# Altium schematic sheet HUB.SchDoc
size A4
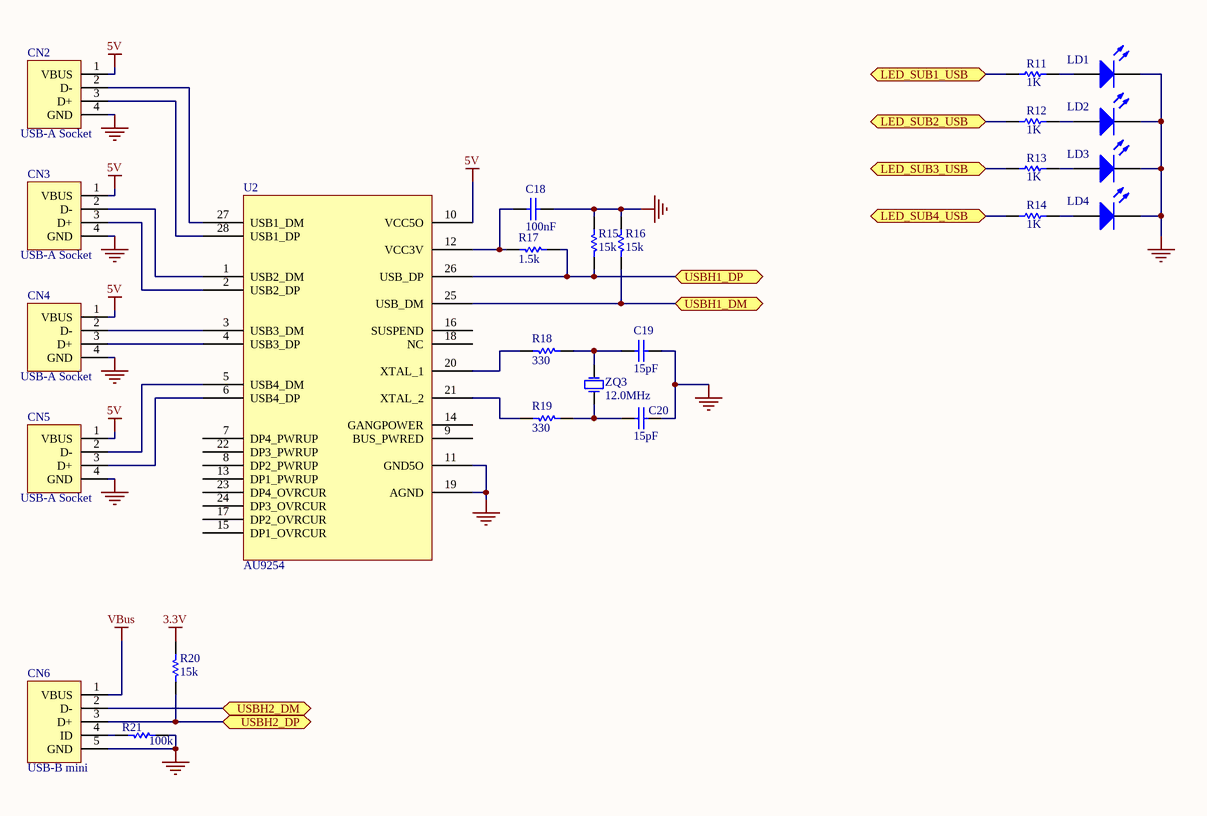
[diagram p0: HUB.SchDoc]

## Parts
C18  value 100nF  [RAD-0.3]  (hidden comment: Cap)
C19  value 15pF  [RAD-0.3]  (hidden comment: Cap)
C20  value 15pF  [RAD-0.3]  (hidden comment: Cap)
CN2  USB-A Socket  [1470695]
CN3  USB-A Socket  [1470695]
CN4  USB-A Socket  [1470695]
CN5  USB-A Socket  [1470695]
CN6  USB-B mini  [USB_micro-B]
LD1  LED1  [LED-1]  (value not drawn)
LD2  LED1  [LED-1]  (value not drawn)
LD3  LED1  [LED-1]  (value not drawn)
LD4  LED1  [LED-1]  (value not drawn)
R11  value 1K  [AXIAL-0.3]  (hidden comment: Res1)
R12  value 1K  [AXIAL-0.3]  (hidden comment: Res1)
R13  value 1K  [AXIAL-0.3]  (hidden comment: Res1)
R14  value 1K  [AXIAL-0.3]  (hidden comment: Res1)
R15  value 15k  [AXIAL-0.3]  (hidden comment: Res1)
R16  value 15k  [AXIAL-0.3]  (hidden comment: Res1)
R17  value 1.5k  [AXIAL-0.3]  (hidden comment: Res1)
R18  value 330  [AXIAL-0.3]  (hidden comment: Res1)
R19  value 330  [AXIAL-0.3]  (hidden comment: Res1)
R20  value 15k  [AXIAL-0.3]  (hidden comment: Res1)
R21  value 100k  [AXIAL-0.3]  (hidden comment: Res1)
U2  AU9254
ZQ3  value 12.0MHz  [R38]  (hidden comment: XTAL)

## Ports
LED_SUB1_USB (bidir), LED_SUB2_USB (bidir), LED_SUB3_USB (bidir), LED_SUB4_USB (bidir), USBH1_DM (bidir), USBH1_DP (bidir), USBH2_DM (bidir), USBH2_DP (bidir)

## Nets
3.3V: R20.2
5V: CN2.1(VBUS) CN3.1(VBUS) CN4.1(VBUS) CN5.1(VBUS) U2.10(VCC5O)
GND: C18.2 C19.2 C20.2 CN2.4(GND) CN3.4(GND) CN4.4(GND) CN5.4(GND) CN6.5(GND) LD1.2(K) LD2.2(K) LD3.2(K) LD4.2(K) R15.2 R16.2 R21.2 U2.11(GND5O) U2.19(AGND)
VBus: CN6.1(VBUS)
LED_SUB1_USB: R11.2 ; port LED_SUB1_USB
LED_SUB2_USB: R12.2 ; port LED_SUB2_USB
LED_SUB3_USB: R13.2 ; port LED_SUB3_USB
LED_SUB4_USB: R14.2 ; port LED_SUB4_USB
USBH1_DM: R16.1 U2.25(USB_DM) ; port USBH1_DM
USBH1_DP: R15.1 R17.2 U2.26(USB_DP) ; port USBH1_DP
USBH2_DM: CN6.2(D-) ; port USBH2_DM
USBH2_DP: CN6.3(D+) R20.1 ; port USBH2_DP
NetC18_1: C18.1 R17.1 U2.12(VCC3V)
NetC19_1: C19.1 R18.2 ZQ3.2(OSC2)
NetC20_1: C20.1 R19.2 ZQ3.1(OSC1)
NetCN2_2: CN2.2(D-) U2.27(USB1_DM)
NetCN2_3: CN2.3(D+) U2.28(USB1_DP)
NetCN3_2: CN3.2(D-) U2.1(USB2_DM)
NetCN3_3: CN3.3(D+) U2.2(USB2_DP)
NetCN4_2: CN4.2(D-) U2.3(USB3_DM)
NetCN4_3: CN4.3(D+) U2.4(USB3_DP)
NetCN5_2: CN5.2(D-) U2.5(USB4_DM)
NetCN5_3: CN5.3(D+) U2.6(USB4_DP)
NetCN6_4: CN6.4(ID) R21.1
NetLD1_1: LD1.1(A) R11.1
NetLD2_1: LD2.1(A) R12.1
NetLD3_1: LD3.1(A) R13.1
NetLD4_1: LD4.1(A) R14.1
NetR18_1: R18.1 U2.20(XTAL_1)
NetR19_1: R19.1 U2.21(XTAL_2)

Not connected (* = marked no-connect by the designer): U2 7(DP4_PWRUP) 8(DP2_PWRUP) 9(BUS_PWRED) 13(DP1_PWRUP) 14(GANGPOWER) 15(DP1_OVRCUR) 16(SUSPEND) 17(DP2_OVRCUR) 18(NC) 22(DP3_PWRUP) 23(DP4_OVRCUR) 24(DP3_OVRCUR)

## Library data of the parts
C18-C20 = Cap: Capacitor; Published: 8-Jun-2000; LatestRevisionDate: 17-Jul-2002; LatestRevisionNote: Re-released for DXP Platform.; PackageReference: RAD-0.3; Publisher: Altium Limited; PackageDescription: Radial Cap, Thru-Hole; 2 Leads; 0.3 in Pin Spacing
CN2-CN5 = USB-A: USB 1.1, Right Angle, SMT, A Type, Plug, 4 Position, Black; ContactMaterial: Brass; ContactPlating: Gold (30) over Nickel (50); PCB_Layout: Complies with manufacturer's recommendation.; DrillSize: Corresponds to nominal value.; PanelGround: Without; Published: 15-Jul-2004; DatasheetDocument: 21-Jan-2003; PackageDocument: 21-Jan-2003; PackageReference: 1470695; Publisher: Altium Limited; HousingMaterial: Thermoplastic; ComponentLink1Description: Manufacturer Link; ComponentLink1URL: http://www.tycoelectronics.com/; ComponentLink2Description: Packaging Specification; ComponentLink2URL: http://ecommas.tycoelectronics.com/commerce/DocumentDelivery/DDEController?Action=showdoc&DocId=Customer+Drawing%7F1470695%7FO%7Fpdf%7FEnglish%7FC_1470695_O.pdf
LD1-LD4 = LED1: Typical RED GaAs LED; Published: 8-Jun-2000; LatestRevisionDate: 08-Jul-2005; LatestRevisionNote: Mech Layer 1 removed.; PackageReference: LED-1; Publisher: Altium Limited; PackageDescription: LED; 2 Leads
R11-R21 = Res1: Resistor; Published: 8-Jun-2000; LatestRevisionDate: 17-Jul-2002; LatestRevisionNote: Re-released for DXP Platform.; PackageReference: AXIAL-0.3; Publisher: Altium Limited; PackageDescription: Axial Device, Thru-Hole; 2 Leads; 0.3 in Pin Spacing
ZQ3 = XTAL: Crystal Oscillator; Published: 8-Jun-2000; LatestRevisionDate: 17-Jul-2002; LatestRevisionNote: Re-released for DXP Platform.; PackageReference: R38; Publisher: Altium Limited; PackageDescription: Crystal, Thru-Hole; 2 Leads; Body 3.1 x 8.2 mm (Dia.xH)